# EAGLE schematic ControlC (EAGLE 7.5.0)
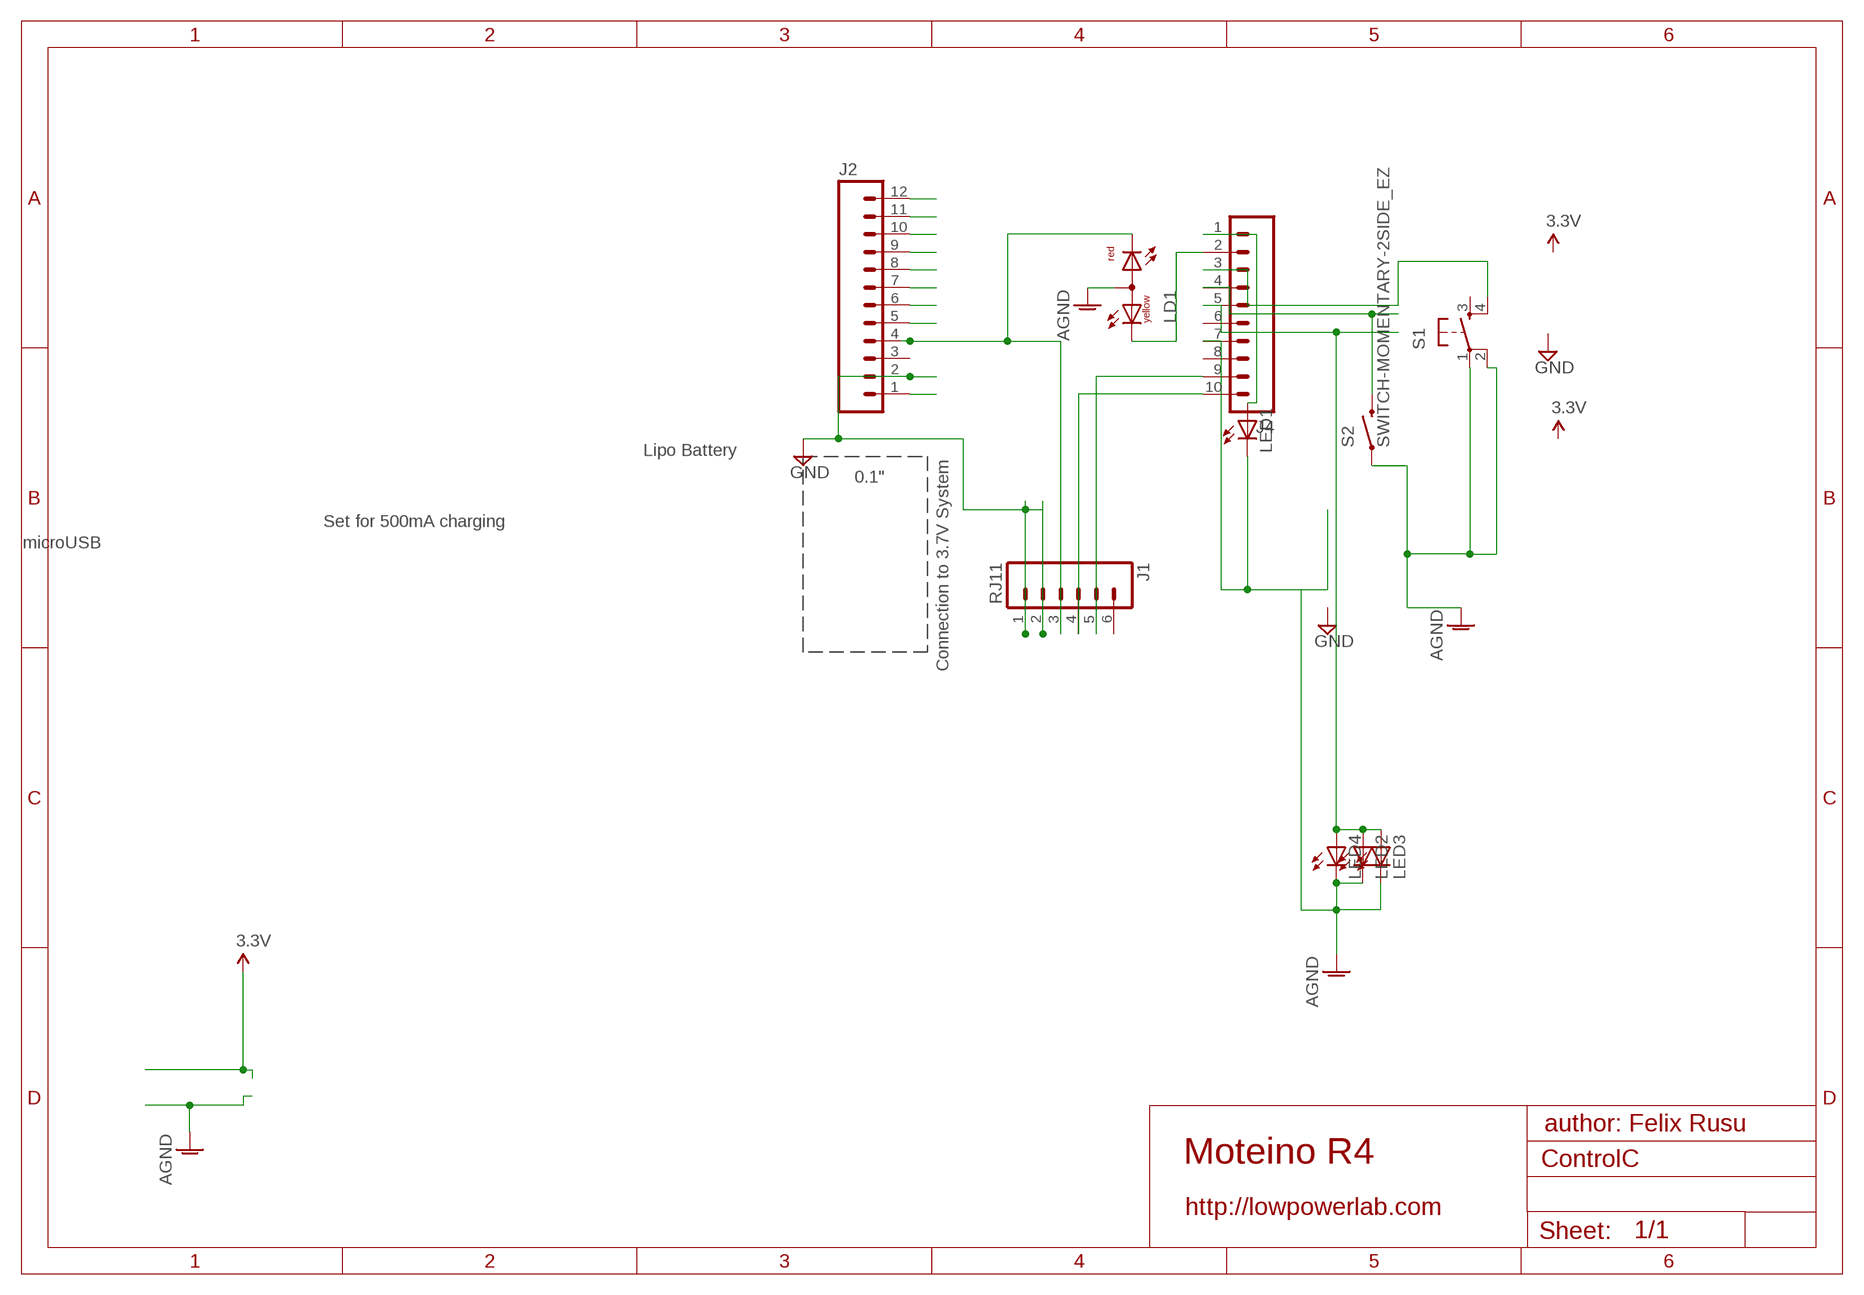
[diagram p0: schematic, sheet 1]

## Parts
J1  RJ11  RJ11-6PTH  [RJ11-6]
J2  M12PTH  [1X12]
J4  M10SILK_FEMALE_PTH  [1X10]
LD1  DUOLED-RY-A  [DUOLED-A-5MM]
LED1  LED3MM  [LED3MM]
LED2  LED3MM  [LED3MM]
LED3  LED3MM  [LED3MM]
LED4  LED3MM  [LED3MM]
S1  TAC_SWITCHPTH  [TACTILE-PTH]
S2  SWITCH-MOMENTARY-2SIDE_EZ  [TACTILE-PTH-SIDEEZ]

## Nets
AGND [power]: J4.7 LD1.A LED1.K(C) LED2.K(C) LED3.K(C) LED4.K(C) S1.1 S1.2 S2.1
GND [power]: J1.1 J1.2 J2.2
N$1: J4.4 S2.2
N$2: J4.2 LD1.CX(CY)
N$3: J4.3 S1.4
N$4: J1.4 J4.10
N$5: J4.5 LED2.A LED3.A LED4.A
N$6: J1.5 J4.9
N$7: J2.1
N$8: J4.1 LED1.A
N$9: J2.5
N$11: J2.6
N$12: J2.7
N$13: J2.8
N$14: J2.9
N$15: J2.10
N$16: J2.11
N$17: J2.12
VIN: J1.3 J2.4 LD1.CR
Unconnected: J1.6 J2.3 J4.6 J4.8 S1.3

## Notes on the sheet
- Lipo Battery
- 0.1"
- Set for 500mA charging
- microUSB
- Connection to 3.7V System
- author: Felix Rusu
- Moteino R4
- http://lowpowerlab.com

## Library data of the parts
J1 = SparkFun-Connectors:RJ11-6: RJ11 Jack Simple 6 pin RJ11 jack. Commonly found on CAT3 devices and Microchip programmers. SKU: PRT-00132; PROD_ID: CONN-08590
J2 = SparkFun-Connectors:M12: Header 12 Standard 12-pin 0.1" header. Use with straight break away headers (SKU : PRT-00116), right angle break away headers (PRT-00553), swiss pins (PRT-00743), machine pins (PRT-00117), and female headers (PRT-00115).
J4 = SparkFun-Connectors:M10: Header 10 Standard 10-pin 0.1" header. Use with straight break away headers (SKU : PRT-00116), right angle break away headers (PRT-00553), swiss pins (PRT-00743), machine pins (PRT-00117), and female headers (PRT-00115).; PROD_ID: CONN-11563
LD1 = led:DUOLED-RY-A: DUO LED 2 colors (red/yellow), 5 mm, round, common Anode www.ligitek.com or other producers.
LED1-LED4 = led:LED: LED OSRAM: - CHIPLED LG R971, LG N971, LY N971, LG Q971, LY Q971, LO R971, LY R971 LH N974, LH R974 LS Q976, LO Q976, LY Q976 LO Q996 - Hyper CHIPLED LW Q18S LB Q993, LB Q99A, LB R99A - SideLED LS A670, LO A670, LY A670, LG A670, LP A670 LB A673, LV A673, LT A673, LW A673 LH A674 LY A675 LS A676, LA A676, LO A676, LY A676, LW A676 LS A679, LY A679, LG A679 - Hyper Micro SIDELED® LS Y876, LA Y876, LO Y876, LY Y876 LT Y87S - SmartLED LW L88C, LW L88S LB L89C, LB L89S, LG L890 LS L89K, LO L89K, LY L89K LS L896, LA L896, LO L896, LY L896 - TOPLED LS T670, LO T670, LY T670, LG T670, LP T670 LSG T670, LSP T670, LSY T670, LOP T670, LYG T670 LG T671, LOG T671, LSG T671 LB T673, LV T673, LT T673, LW T673 LH T674 LS T676, LA T676, LO T676, LY T676, LB T676, LH T676, LSB T676, LW T676 LB T67C, LV T67C, LT T67C, LS T67K, LO T67K, LY T67K, LW E67C LS E67B, LA E67B, LO E67B, LY E67B, LB E67C, LV E67C, LT E67C LW T67C LS T679, LY T679, LG T679 LS T770, LO T770, LY T770, LG T770, LP T770 LB T773, LV T773, LT T773, LW T773 LH T774 LS E675, LA E675, LY E675, LS T675 LS T776, LA T776, LO T776, LY T776, LB T776 LHGB T686 LT T68C, LB T68C - Hyper Mini TOPLED® LB M676 - Mini TOPLED Santana® LG M470 LS M47K, LO M47K, LY M47K Source: http://www.osram.convergy.de LUXEON: - LUMILED® LXK2-PW12-R00, LXK2-PW12-S00, LXK2-PW14-U00, LXK2-PW14-V00 LXK2-PM12-R00, LXK2-PM12-S00, LXK2-PM14-U00 LXK2-PE12-Q00, LXK2-PE12-R00, LXK2-PE12-S00, LXK2-PE14-T00, LXK2-PE14-U00 LXK2-PB12-K00, LXK2-PB12-L00, LXK2-PB12-M00, LXK2-PB14-N00, LXK2-PB14-P00, LXK2-PB14-Q00 LXK2-PR12-L00, LXK2-PR12-M00, LXK2-PR14-Q00, LXK2-PR14-R00 LXK2-PD12-Q00, LXK2-PD12-R00, LXK2-PD12-S00 LXK2-PH12-R00, LXK2-PH12-S00 LXK2-PL12-P00, LXK2-PL12-Q00, LXK2-PL12-R00 Source: www.luxeon.com KINGBRIGHT: KA-3528ASYC Source: www.kingbright.com
S1 = SparkFun-Retired:TAC_SWITCH: Momentary Switch Button commonly used for reset or general input. Spark Fun Electronics SKU : COM-00097 SMT- SWCH-08247
S2 = SparkFun-Electromechanical:SWITCH-MOMENTARY-2: Various NO switches- pushbuttons, reed, etc

## Net classes
1 power: width 0.381 mm, clearance 0.254 mm